# Altium schematic sheet Magneto.SchDoc
size A4; SheetNumber: 3; SheetTotal: 3
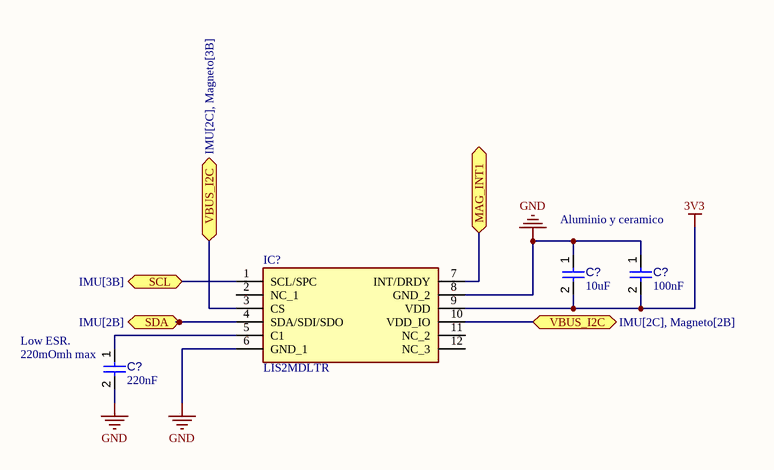
[diagram p0: Magneto.SchDoc]

## Parts
(Parts that share a designator on the sheet are numbered #1, #2 ... from top to bottom, then left to right.)
C?#1  value 10uF  [CAPC1005X56X25ML10T15]  (hidden comment: Capacitor 0.1 uF +/- 5% 16 V 0402)
C?#2  value 100nF  [CAPC1005X56X25ML10T15]  (hidden comment: Capacitor 0.1 uF +/- 5% 16 V 0402)
C?#3  value 220nF  [CAPC1005X56X25ML10T15]  (hidden comment: Capacitor 0.1 uF +/- 5% 16 V 0402)
IC?  LIS2MDLTR  [LGA-12]

## Ports
MAG_INT1 (bidir), SCL (bidir, see IMU[3B]), SDA (bidir, see IMU[2B]), VBUS_I2C (bidir, see IMU[2C], Magneto[2B]), VBUS_I2C (bidir, see IMU[2C], Magneto[3B])

## Nets
3V3: C?#1.2 C?#2.2 IC?.9(VDD)
GND: C?#1.1 C?#2.1 C?#3.2 IC?.6(GND_1) IC?.8(GND_2)
MAG_INT1: IC?.7(INT/DRDY) ; port MAG_INT1
SCL: IC?.1(SCL/SPC) ; port SCL
SDA: IC?.4(SDA/SDI/SDO) ; port SDA
VBUS_I2C: IC?.3(CS) IC?.10(VDD_IO) ; port VBUS_I2C
NetC?#3_1: C?#3.1 IC?.5(C1)

Not connected (* = marked no-connect by the designer): IC? 2(NC_1) 11(NC_2) 12(NC_3)

## Notes on the sheet
- (near C?#1) Aluminio y ceramico
- (near C?#3) Low ESR.
- (near C?#3) 220mOmh max

## Library data of the parts
C?#1-C?#3 = CMP-001-00001-4: Chip Capacitor, 0.1 uF, +/- 5%, 16 V, 0402 (1005 Metric); Voltage Rating: 16V; Capacitor Type: Ceramic; Pins: 2; Min Operating Temperature: -55°C; Mounting Technology: SM; Max Operating Temperature: 125°C; RoHS Compliant: True; Case/Package: 0402; Tolerance: 5%
IC? = LIS2MDLTR: Integrated Circuit; Manufacturer_Name: STMicroelectronics; Datasheet Link: http://www.st.com/content/ccc/resource/technical/document/datasheet/group3/29/13/d1/e0/9a/4d/4f/30/DM00395193/files/DM00395193.pdf/jcr:content/translations/en.DM00395193.pdf; Manufacturer_Part_Number: LIS2MDLTR; Mouser Part Number: 511-LIS2MDLTR; Mouser Price/Stock: https://www.mouser.co.uk/ProductDetail/STMicroelectronics/LIS2MDLTR?qs=5aG0NVq1C4wS0n6b5NiBNQ%3D%3D; Arrow Part Number: LIS2MDLTR; Arrow Price/Stock: https://www.arrow.com/en/products/lis2mdltr/stmicroelectronics?region=nac